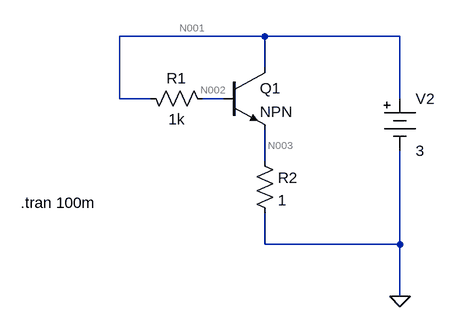
[diagram p0: schematic Yoneda-p94__Transistor__v2_Same-battery.asc]
Yoneda-p94__Transistor__v2_Same-battery.asc, the LTspice schematic file:
Version 4
SHEET 1 880 680
WIRE 288 -32 64 -32
WIRE 496 -32 288 -32
WIRE 288 16 288 -32
WIRE 64 64 64 -32
WIRE 112 64 64 64
WIRE 224 64 192 64
WIRE 496 64 496 -32
WIRE 288 160 288 112
WIRE 288 288 288 240
WIRE 496 288 496 144
WIRE 496 288 288 288
WIRE 496 368 496 288
FLAG 496 368 0
SYMBOL res 208 80 M270
WINDOW 0 32 56 VTop 2
WINDOW 3 0 56 VBottom 2
SYMATTR InstName R1
SYMATTR Value 1k
SYMBOL res 272 144 R0
WINDOW 0 36 42 Left 2
SYMATTR InstName R2
SYMATTR Value 1
SYMBOL Misc\\battery 496 48 R0
SYMATTR InstName V2
SYMATTR Value 3
SYMBOL npn 224 16 R0
SYMATTR InstName Q1
TEXT -88 224 Left 2 !.tran 100m

The netlist it stands for:
* Yoneda-p94__Transistor__v2_Same-battery.asc
R1 N002 N001 1k
R2 N003 0 1
V2 N001 0 3
Q1 N001 N002 N003 0 NPN
.model NPN NPN
.model PNP PNP
.lib standard.bjt
.tran 100m
.backanno
.end

* Results of the author's LTspice run, read from the files saved beside the schematic
* Operating Point, zero values left out:
*   V(n002) = 1.102 V
*   V(n001) = 3 V
*   V(n003) = 191.7 mV
*   Ic(Q1) = 189.8 mA
*   Ib(Q1) = 1.898 mA
*   Ie(Q1) = -191.7 mA
*   I(R2) = 191.7 mA
*   I(R1) = -1.898 mA
*   I(V2) = -191.7 mA